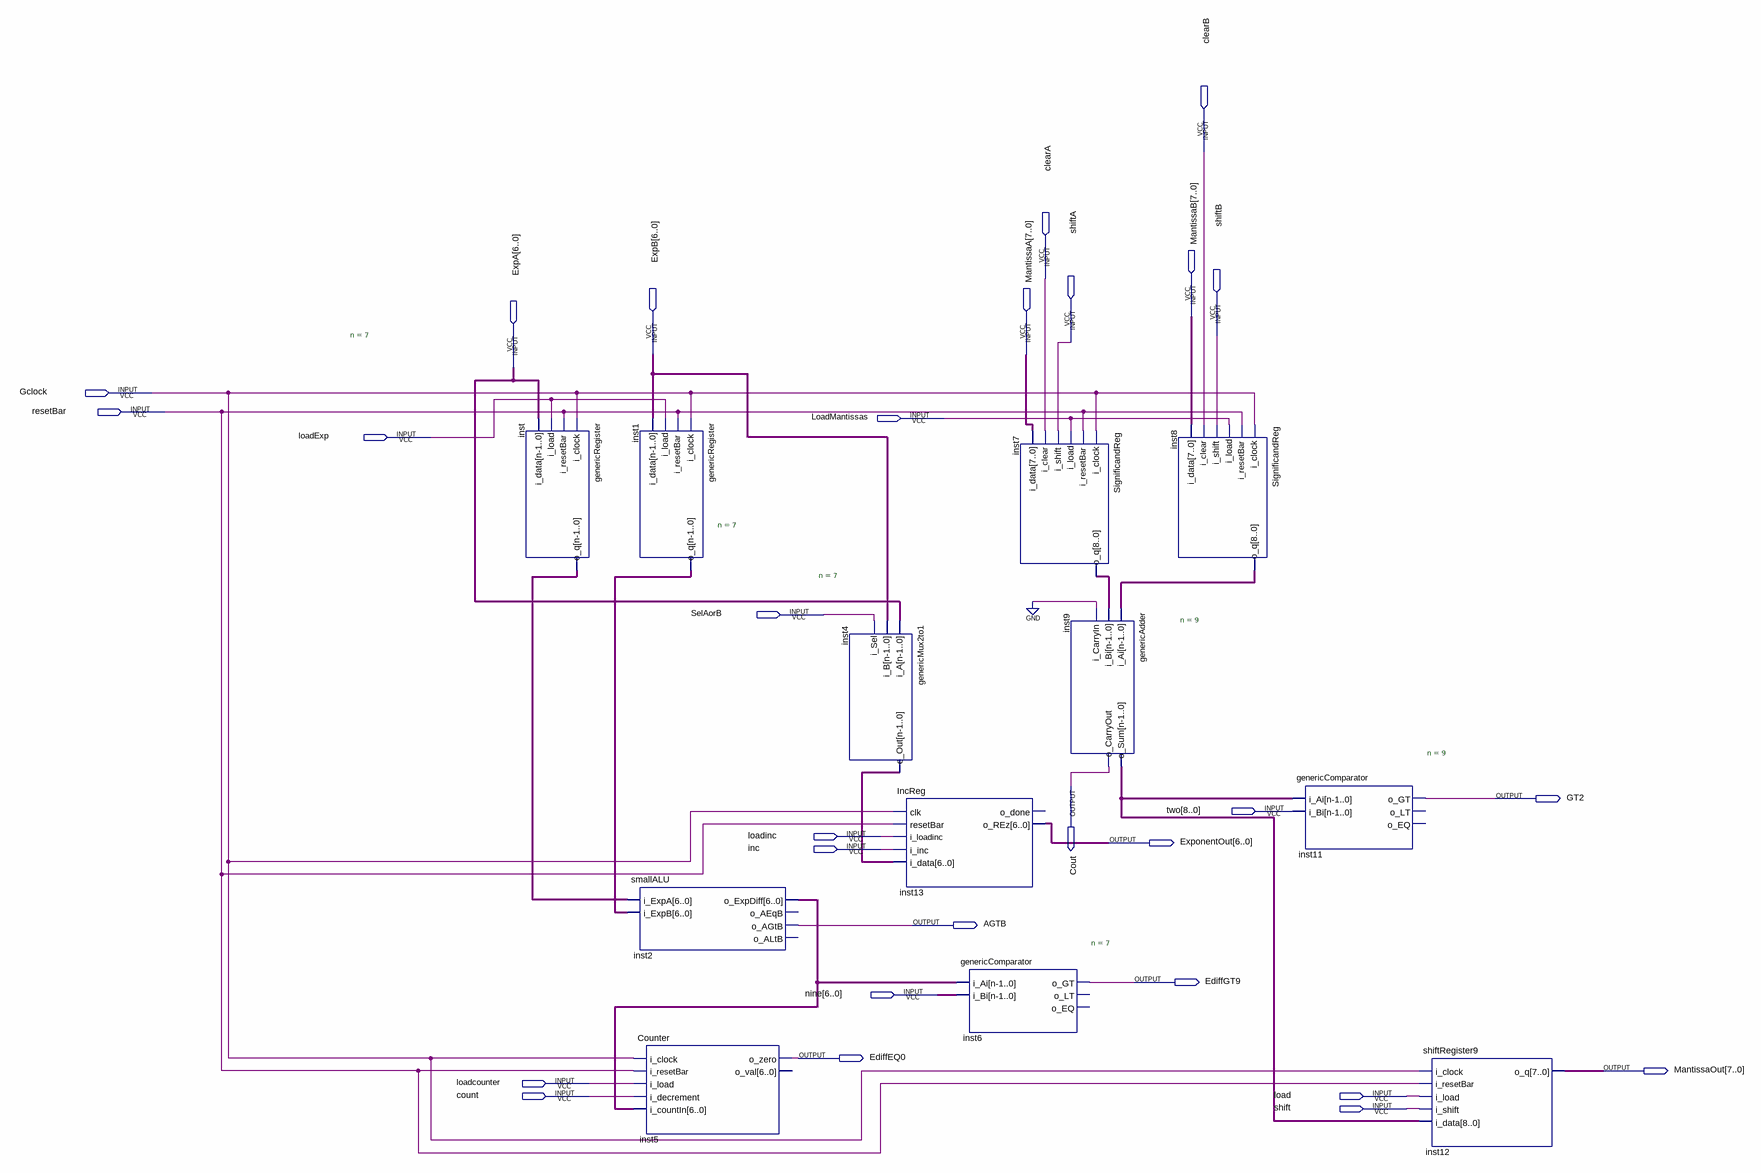
[diagram p0: schematic sheet]
// Quartus schematic topaddnew.bdf as structural Verilog: 12 symbols, 28 pins
module topaddnew (
  input  clearB,
  input  clearA,
  input  [7:0] MantissaB,
  input  shiftB,
  input  shiftA,
  input  [6:0] ExpB,
  input  [7:0] MantissaA,
  input  [6:0] ExpA,
  input  Gclock,
  input  resetBar,
  input  LoadMantissas,
  input  loadExp,
  input  SelAorB,
  input  [8:0] two,
  input  loadinc,
  input  inc,
  input  [6:0] nine,
  input  loadcounter,
  input  count,
  input  load,
  input  shift,
  output Cout,
  output GT2,
  output [6:0] ExponentOut,
  output AGTB,
  output EdiffGT9,
  output EdiffEQ0,
  output [7:0] MantissaOut
);

  wire [6:0] inst1_o_q, inst2_o_expdiff, inst4_o_out, inst_o_q;
  wire [8:0] inst7_o_q, inst8_o_q, inst9_o_sum;

  genericRegister #(.n(7)) inst (
    .i_clock(Gclock), .i_resetBar(resetBar), .i_load(loadExp), .i_data(ExpA), .o_q(inst_o_q));
  genericRegister #(.n(7)) inst1 (
    .i_clock(Gclock), .i_resetBar(resetBar), .i_load(loadExp), .i_data(ExpB), .o_q(inst1_o_q));
  smallALU inst2 (
    .i_ExpA(inst_o_q), .i_ExpB(inst1_o_q), .o_ExpDiff(inst2_o_expdiff), .o_AGtB(AGTB));  // open: o_AEqB, o_ALtB
  Counter inst5 (
    .i_clock(Gclock), .i_resetBar(resetBar), .i_load(loadcounter), .i_decrement(count),
    .i_countIn(inst2_o_expdiff), .o_zero(EdiffEQ0));  // open: o_val
  genericMux2to1 #(.n(7)) inst4 (.i_A(ExpA), .i_B(ExpB), .i_Sel(SelAorB), .o_Out(inst4_o_out));
  IncReg inst13 (
    .clk(Gclock), .resetBar(resetBar), .i_loadinc(loadinc), .i_inc(inc), .i_data(inst4_o_out),
    .o_REz(ExponentOut));  // open: o_done
  genericComparator #(.n(7)) inst6 (.i_Ai(inst2_o_expdiff), .i_Bi(nine), .o_GT(EdiffGT9));  // open: o_LT, o_EQ
  SignificandReg inst7 (
    .i_clock(Gclock), .i_resetBar(resetBar), .i_load(LoadMantissas), .i_shift(shiftA), .i_clear(clearA),
    .i_data(MantissaA), .o_q(inst7_o_q));
  genericAdder #(.n(9)) inst9 (
    .i_Ai(inst8_o_q), .i_Bi(inst7_o_q), .i_CarryIn(1'b0), .o_Sum(inst9_o_sum), .o_CarryOut(Cout));
  SignificandReg inst8 (
    .i_clock(Gclock), .i_resetBar(resetBar), .i_load(LoadMantissas), .i_shift(shiftB), .i_clear(clearB),
    .i_data(MantissaB), .o_q(inst8_o_q));
  genericComparator #(.n(9)) inst11 (.i_Ai(inst9_o_sum), .o_GT(GT2));  // open: i_Bi, o_LT, o_EQ
  shiftRegister9 inst12 (
    .i_clock(Gclock), .i_resetBar(resetBar), .i_load(load), .i_shift(shift), .i_data(inst9_o_sum),
    .o_q(MantissaOut));
endmodule
